# EAGLE design T5400_Barometer_Breakout-v01 (EAGLE 6.0)
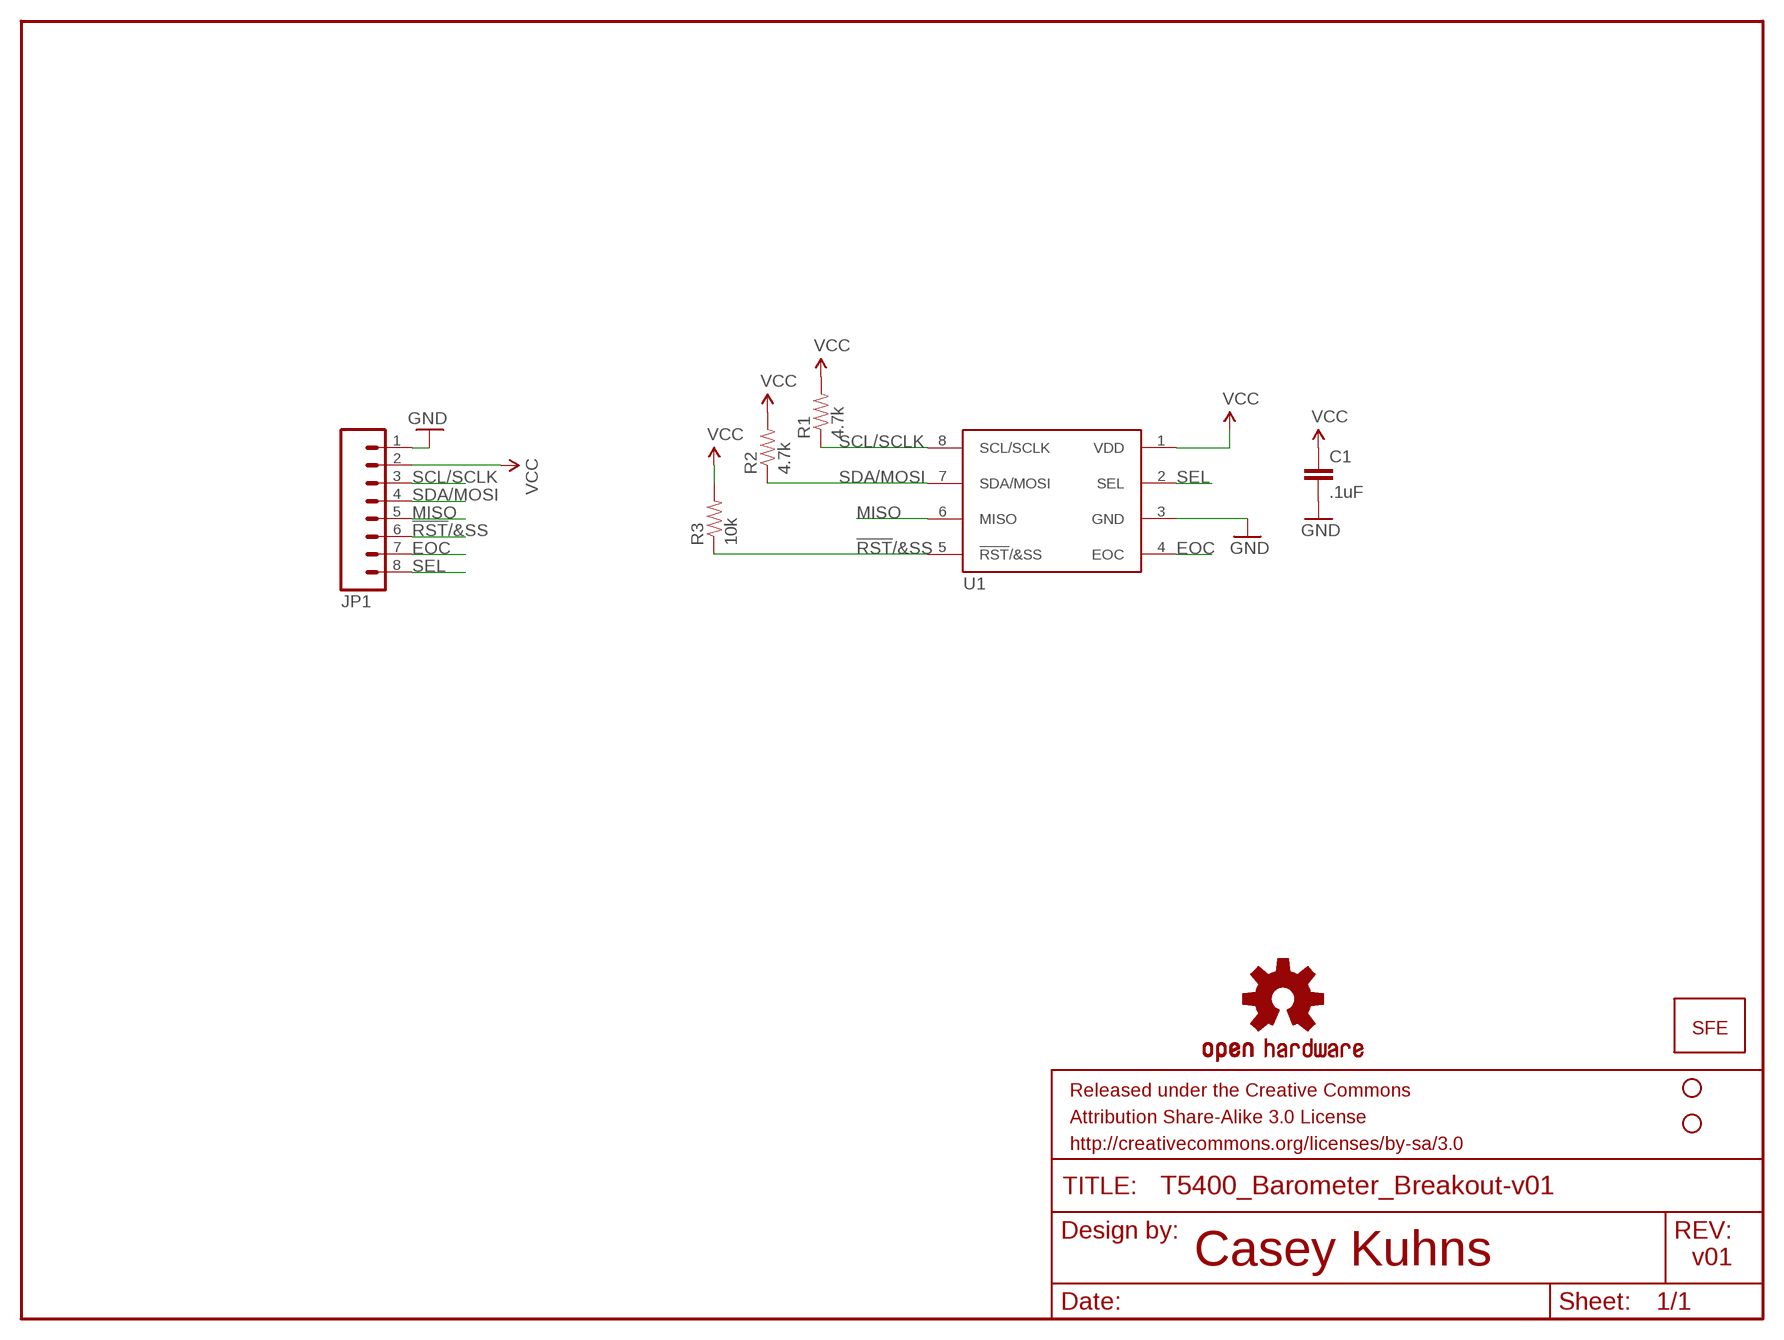
[diagram p0: schematic, sheet 1]

## Parts
C1  .1uF  0.1UF-25V-5%(0603)  [0603-CAP]
FRAME1  FRAME-LETTER  [CREATIVE_COMMONS]
JP1  M081X08  [1X08]
LOGO1  LOGO-SFENEW  [SFE-NEW-WEBLOGO]
LOGO2  OSHW-LOGOS  [OSHW-LOGO-S]
R1  4.7k  RESISTOR0603-RES  [0603-RES]
R2  4.7k  RESISTOR0603-RES  [0603-RES]
R3  10k  RESISTOR0603-RES  [0603-RES]
STANDOFF1  STAND-OFF  [STAND-OFF]
STANDOFF2  STAND-OFF  [STAND-OFF]
U1  T5400  [T5400]

## Nets
!RST!/&SS: JP1.6 R3.1 U1.5(!RST!/&SS)
EOC: JP1.7 U1.4(EOC)
GND: C1.2 JP1.1 U1.3(GND)
MISO: JP1.5 U1.6(MISO)
SCL/SCLK: JP1.3 R1.1 U1.8(SCL/SCLK)
SDA/MOSI: JP1.4 R2.1 U1.7(SDA/MOSI)
SEL: JP1.8 U1.2(SEL)
VCC: C1.1 JP1.2 R1.2 R2.2 R3.2 U1.1(VDD)

## Notes on the sheet
- Casey Kuhns | v01

## Library data of the parts
C1 = SparkFun-Capacitors:0.1UF-25V-5%(0603): CAP-08604; PROD_ID: CAP-08604; VALUE: 0.1uF
FRAME1 = SparkFun-Aesthetics:FRAME-LETTER: Schematic Frame Standard 8.5x11 US Letter frame
JP1 = SparkFun-Connectors:M08: Header 8 Standard 8-pin 0.1" header. Use with straight break away headers (SKU : PRT-00116), right angle break away headers (PRT-00553), swiss pins (PRT-00743), machine pins (PRT-00117), and female headers (PRT-00115).
LOGO1 = SparkFun-Aesthetics:LOGO-SFE: Spark Fun Electronics PCB Logo This is the standard Spark Fun Electronics PCB logo.
LOGO2 = SparkFun-Aesthetics:OSHW-LOGO: Open Source Hardware Logo This logo indicates the piece of hardware it is found on incorporates a OSHW license and/or adheres to the definition of open source hardware found here: http://freedomdefined.org/OSHW
R1-R3 = SparkFun-Passives:RESISTOR: Resistor Basic schematic elements and footprints for 0603, 1206, and PTH resistors.
STANDOFF1 STANDOFF2 = SparkFun-Electromechanical:STAND-OFF: #4 Stand Off This is the mechanical footprint for a #4 phillips button head screw. Use the keepout ring to avoid running the screw head into surrounding components. SKU : PRT-00447
U1 = T5400:T5400

## Board
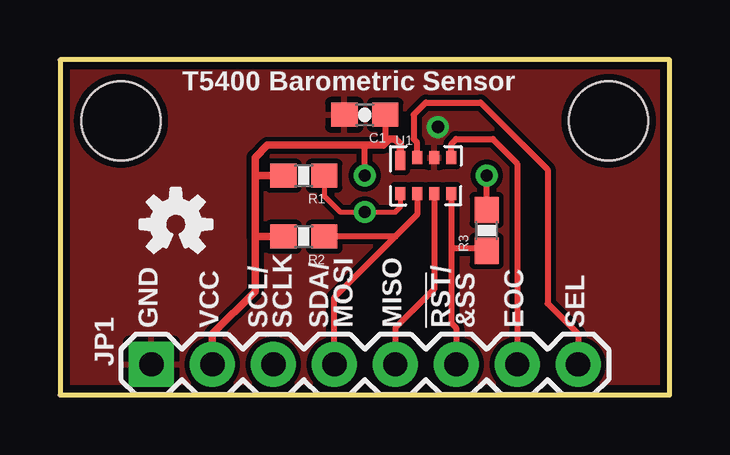
[diagram p1: board, top side]
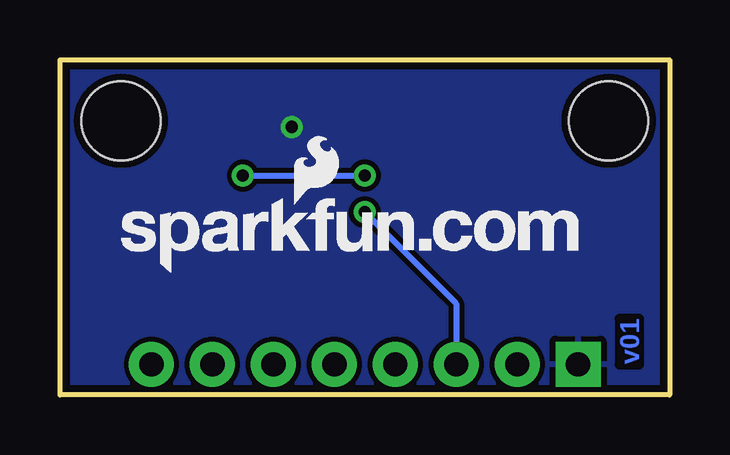
[diagram p2: board, bottom side, seen from below]

Size 25.4 x 13.97 mm. Coordinates in mm from the lower left corner, seen from the top.
Outline: 0,0 25.4,0 25.4,13.97 0,13.97 0,0
Copper layers (1*16): Top 0.035mm / dielectric 1.5mm / Bottom 0.035mm
Design rules: minimum track width 8mil, minimum drill 20mil, track to track 8mil, track to pad 8mil, pad to pad 8mil, via to via 8mil, smd to smd 8mil, copper to edge 12mil, drill to drill 8mil, minimum pad ring 10mil, minimum via ring 8mil, stop-mask expansion 4mil, vias tented up to drill 20mil, thermal gap 10mil

### Footprints (pad centres in the part's own frame; a part is rotated, then mirrored left to right if it is on the bottom)
0603-CAP = smd 1.1 x 1: 1 -0.85,0; 2 0.85,0
1X08 = drill 1.016 pad 1.88 square: 1 0,0 | drill 1.016 pad 1.88: 2 2.54,0; 3 5.08,0; 4 7.62,0; 5 10.16,0; 6 12.7,0; 7 15.24,0; 8 17.78,0
0603-RES = smd 1.1 x 1: 1 -0.85,0; 2 0.85,0
STAND-OFF = hole 3.302: 0,0
T5400 = smd 0.42 x 0.8: 1 -1.065,0.625 | smd 0.42 x 0.55: 2 -0.355,0.75; 3 0.355,0.75; 4 1.065,0.75; 5 1.065,-0.75; 6 0.355,-0.75; 7 -0.355,-0.75; 8 -1.065,-0.75

### Placement (x,y rotation side)
C1  12.7,11.68 180 top
FRAME1  0,-8.89 0 top  (outside the outline)
JP1  3.81,1.27 0 top
LOGO1  22.86,5.08 0 bottom
LOGO2  4.83,7.11 0 top
R1  10.16,9.14 180 top
R2  10.16,6.6 180 top
R3  17.78,6.86 90 top
STANDOFF1  2.54,11.43 0 top
STANDOFF2  22.86,11.43 0 top
U1  15.24,9.14 0 top

### Tracks (layer width: path | path; a pad name or v marks a point on that pad's centre or on a via)
!RST!/&SS
  Top 0.254: U1.5 16.3,6.1 | 16.3,6.1 16.3,3 16.51,2.79 JP1.6 | R3.1 17.69,6.1 16.3,6.1
EOC
  Top 0.254: U1.4 16.3,10.46 16.51,10.67 18.03,10.67 19.05,9.65 JP1.7
GND  (via drill 0.51)
  other vias: 15.75,11.18
  pour Top: 0,0 25.4,0 25.4,13.97 0,13.97
  pour Bottom: 0,0 25.4,0 25.4,13.97 0,13.97
MISO
  Top 0.254: U1.6 15.6,4.42 13.97,2.79 JP1.5
SCL/SCLK  (via drill 0.51)
  Top 0.203: U1.8 14.18,7.83 13.97,7.62 v12.7,7.62 11.68,7.62 11.01,8.29 R1.1
  Bottom 0.254: v12.7,7.62 8.89,3.81 JP1.3
SDA/MOSI
  Top 0.254: U1.7 14.88,7.52 13.97,6.6 | 13.97,6.6 R2.1 | JP1.4 11.43,4.06 13.97,6.6
SEL
  Top 0.254: U1.2 14.88,10.52 14.73,10.67 14.73,11.68 15.24,12.19 17.53,12.19 20.32,9.4 20.32,3.81 21.59,2.54 JP1.8
VCC  (via drill 0.51)
  Top 0.254: R3.2 v17.78,9.14 | v12.7,9.14 12.7,10.41 | C1.1 13.55,10.5 13.46,10.41
  Top 0.305: 8.13,6.6 8.13,9.14 | 8.13,9.14 8.13,9.91 8.64,10.41 12.7,10.41 13.46,10.41 13.72,10.67 13.97,10.67 14.18,10.46 U1.1 | R2.2 8.13,6.6 | R1.2 8.13,9.14 | 8.13,6.6 8.13,4.32 6.35,2.54 JP1.2
  Bottom 0.254: v17.78,9.14 v12.7,9.14

### Text on the board
Bottom: v01
tPlace: T5400 Barometric Sensor | GND | VCC | SCL/ | SCLK | SDA/ | MOSI | MISO | !RST!/ | &SS | EOC | SEL